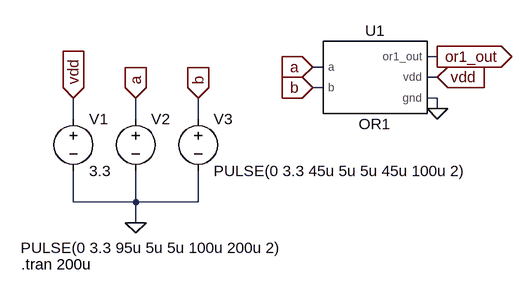
[diagram p0: schematic or1_test.asc]
or1_test.asc, the LTspice schematic file:
Version 4.1
SHEET 1 880 680
WIRE 304 112 288 112
WIRE 128 128 112 128
WIRE 304 144 288 144
WIRE 128 160 112 160
WIRE 304 176 288 176
WIRE 304 192 304 176
WIRE -256 208 -256 176
WIRE -160 208 -160 176
WIRE -64 208 -64 176
WIRE -256 336 -256 288
WIRE -160 336 -160 288
WIRE -160 336 -256 336
WIRE -64 336 -64 288
WIRE -64 336 -160 336
WIRE -160 368 -160 336
FLAG -160 368 0
FLAG -256 176 vdd
IOPIN -256 176 In
FLAG -160 176 a
IOPIN -160 176 In
FLAG -64 176 b
IOPIN -64 176 In
FLAG 304 192 0
FLAG 304 144 vdd
IOPIN 304 144 In
FLAG 304 112 or1_out
IOPIN 304 112 Out
FLAG 112 128 a
IOPIN 112 128 In
FLAG 112 160 b
IOPIN 112 160 In
SYMBOL or1 208 144 R0
SYMATTR InstName U1
SYMBOL voltage -256 192 R0
WINDOW 123 0 0 Left 0
WINDOW 39 0 0 Left 0
SYMATTR InstName V1
SYMATTR Value 3.3
SYMBOL voltage -160 192 R0
WINDOW 3 -177 215 Left 2
WINDOW 123 0 0 Left 0
WINDOW 39 0 0 Left 0
SYMATTR Value PULSE(0 3.3 95u 5u 5u 100u 200u 2)
SYMATTR InstName V2
SYMBOL voltage -64 192 R0
WINDOW 123 0 0 Left 0
WINDOW 39 0 0 Left 0
SYMATTR InstName V3
SYMATTR Value PULSE(0 3.3 45u 5u 5u 45u 100u 2)
TEXT -336 432 Left 2 !.tran 200u

The netlist it stands for:
* or1_test.asc
X§U1 a b or1_out vdd 0 OR1 OR1  ; pins a b or1_out vdd gnd
V1 vdd 0 3.3
V2 a 0 PULSE(0 3.3 95u 5u 5u 100u 200u 2)
V3 b 0 PULSE(0 3.3 45u 5u 5u 45u 100u 2)
.tran 200u
.lib ltspice_cmdc0de.lib
.backanno
.end